# EAGLE schematic source_eagle (EAGLE 9.6.2)
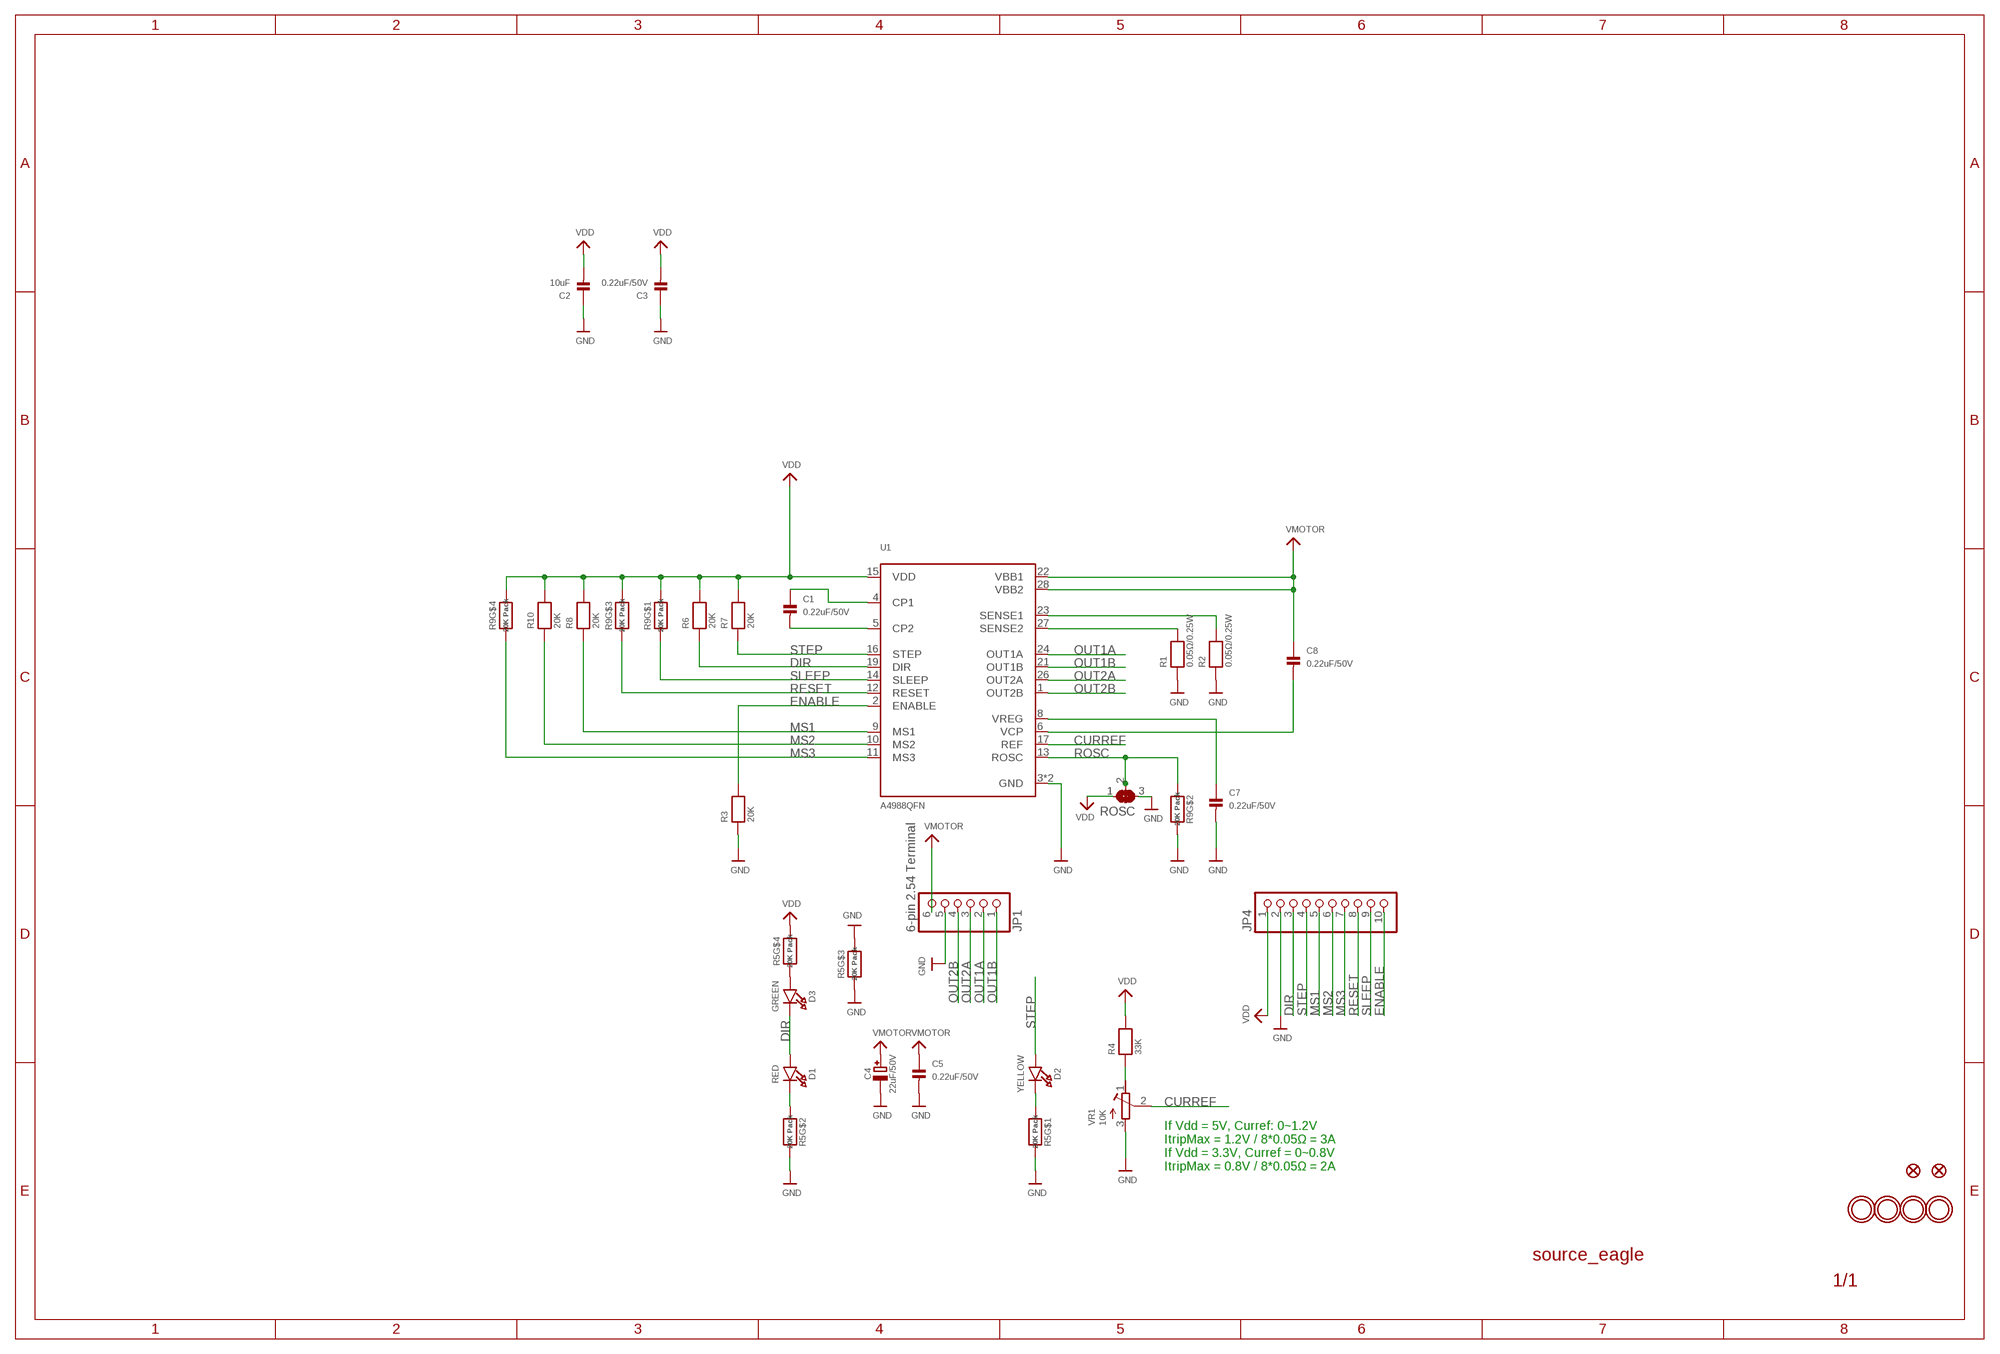
[diagram p0: schematic, sheet 1]

## Parts
C1  0.22uF/50V  CAP_CERAMIC0603_NO  [0603-NO]
C2  10uF  CAP_CERAMIC0805-NOOUTLINE  [0805-NO]
C3  0.22uF/50V  CAP_CERAMIC0603_NO  [0603-NO]
C4  22uF/50V  CAP_ELECTROLYTICPANASONIC_C  [PANASONIC_C]
C5  0.22uF/50V  CAP_CERAMIC0603_NO  [0603-NO]
C7  0.22uF/50V  CAP_CERAMIC0603_NO  [0603-NO]
C8  0.22uF/50V  CAP_CERAMIC0603_NO  [0603-NO]
D1  RED  LED0603_NOOUTLINE  [CHIPLED_0603_NOOUTLINE]
D2  YELLOW  LED0603_NOOUTLINE  [CHIPLED_0603_NOOUTLINE]
D3  GREEN  LED0603_NOOUTLINE  [CHIPLED_0603_NOOUTLINE]
JP1  6-pin 2.54 Terminal  HEADER-1X6_2.54MMTERM  [1X06_2.54MMTERMINAL]
JP4  HEADER-1X1070MIL  [1X10_ROUND70]
R1  0.05Ω/0.25W  RESISTOR_0603_NOOUT  [0603-NO]
R2  0.05Ω/0.25W  RESISTOR_0603_NOOUT  [0603-NO]
R3  20K  RESISTOR_0603_NOOUT  [0603-NO]
R4  33K  RESISTOR_0603_NOOUT  [0603-NO]
R5  20K Pack  RESISTOR_4PACK  [RESPACK_4X0603]
R6  20K  RESISTOR_0603_NOOUT  [0603-NO]
R7  20K  RESISTOR_0603_NOOUT  [0603-NO]
R8  20K  RESISTOR_0603_NOOUT  [0603-NO]
R9  20K Pack  RESISTOR_4PACK  [RESPACK_4X0603]
R10  20K  RESISTOR_0603_NOOUT  [0603-NO]
ROSC  SOLDERJUMPER_2WAY  [SOLDERJUMPER_2WAY_OPEN_NOPASTE]
U1  A4988QFN  A4983_LOGICAL  [QFN28_5MM]
U$10  FIDUCIAL_0.5MM  [FIDUCIAL_0.5MM]
U$11  FIDUCIAL_0.5MM  [FIDUCIAL_0.5MM]
U$18  MOUNTINGHOLE2.0  [MOUNTINGHOLE_2.0_PLATED]
U$22  MOUNTINGHOLE2.0  [MOUNTINGHOLE_2.0_PLATED]
U$26  MOUNTINGHOLE2.0  [MOUNTINGHOLE_2.0_PLATED]
U$27  MOUNTINGHOLE2.0  [MOUNTINGHOLE_2.0_PLATED]
VR1  10K  R-TRIMM3314J  [RTRIM3314J]

## Nets
CURREF: U1.17(REF) VR1.2(S)
DIR: D1.A D3.C JP4.3 R6.1 U1.19(DIR)
ENABLE: JP4.10 R3.2 U1.2(ENABLE)
GND: C2.1 C3.1 C4.- C5.2 C7.2 JP1.5 JP4.2 R1.1 R2.1 R3.1 R5.3 R5.6 R5.7 R5.8 R9.7 ROSC.3 U1.3(GND) U1.THERMAL(GND) VR1.3(A)
MS1: JP4.5 R8.1 U1.9(MS1)
MS2: JP4.6 R10.1 U1.10(MS2)
MS3: JP4.7 R9.4 U1.11(MS3)
N$1: D2.C R5.1
N$2: C1.1 U1.4(CP1)
N$3: C1.2 U1.5(CP2)
N$4: C8.2 U1.6(VCP)
N$5: R1.2 U1.27(SENSE2)
N$6: R2.2 U1.23(SENSE1)
N$7: C7.1 U1.8(VREG)
N$8: D1.C R5.2
N$9: R4.1 VR1.1(E)
N$10: D3.A R5.4
OUT1A: JP1.2 U1.24(OUT1A)
OUT1B: JP1.1 U1.21(OUT1B)
OUT2A: JP1.3 U1.26(OUT2A)
OUT2B: JP1.4 U1.1(OUT2B)
RESET: JP4.8 R9.3 U1.12(RESET)
ROSC: R9.2 ROSC.2 U1.13(ROSC)
SLEEP: JP4.9 R9.1 U1.14(SLEEP)
STEP: D2.A JP4.4 R7.1 U1.16(STEP)
VDD: C2.2 C3.2 JP4.1 R4.2 R5.5 R6.2 R7.2 R8.2 R9.5 R9.6 R9.8 R10.2 ROSC.1 U1.15(VDD)
VMOTOR: C4.+ C5.1 C8.1 JP1.6 U1.22(VBB1) U1.28(VBB2)

## Notes on the sheet
- If Vdd = 5V, Curref: 0~1.2V
  ItripMax = 1.2V / 8*0.05Ω = 3A
  If Vdd = 3.3V, Curref = 0~0.8V
  ItripMax = 0.8V / 8*0.05Ω = 2A

## Library data of the parts
C1-C3 C5 C7 C8 = microbuilder:CAP_CERAMIC: Ceramic Capacitors For new designs, use the packages preceded by an '_' character since they are more reliable: The following footprints should be used on most boards: _0402 - Standard footprint for regular board layouts _0603 - Standard footprint for regular board layouts _0805 - Standard footprint for regular board layouts _1206 - Standard footprint for regular board layouts For extremely tight-pitch boards where space is at a premium, the following 'micro-pitch' footprints can be used (smaller pads, no silkscreen outline, etc.): _0402MP - Micro-pitch footprint for very dense/compact boards _0603MP - Micro-pitch footprint for very dense/compact boards _0805MP - Micro-pitch footprint for very dense/compact boards _1206MP - Micro-pitch footprint for very dense/compact boards
C4 = microbuilder:CAP_ELECTROLYTIC: Electrolytic Capacitors SMT PANASONIC_C - Size C Panasonic Electrolytic Aluminum Capacitor 47µF 16V 20% Electrolytic Capacitor [Digikey: PCE3890TR-ND] PANASONIC_D - Size D Panasonic Electrolytic Aluminum Capacitor 100µF 25V 20% Electrolytic Capacitor [Digikey: PCE3898TR-ND] PTH 3.5 mm grid, 8 mm diameter ... 3.5 mm grid, 10 mm diameter ...
D1-D3 = microbuilder:LED: LED 0603 - 0603 Surface Mount Package 2mA: Green LED - Low Power (3.9mcd, 2ma, 1.7Vf) - Digikey: 475-2709-2-ND Orange LED - Low Power (9.8mcd, 2ma, 1.8Vf) - Digikey: 475-1194-2-ND Red LED - Low Power (5mcd, 2ma, 1.8Vf) - Digikey: 475-1195-2-ND Yellow LED - Low Power (7mcd, 2ma, 1.8Vf) - Digikey: 475-1196-2-ND 5mA: Blue LED - Low Power (17mcd, 5ma, 2.9Vf) - Digikey: LNJ937W8CRACT-ND 0805 - 0805 Surface Mount Package 2mA: Red LED (8.8mcd, 2mA, 1.8Vf, Clear) - Low Power [Digikey: 475-2510-1-ND] Green LED (5mcd, 2mA, 1.8Vf, Clear) - Low Power [Digikey: 475-2730-1-ND] Yellow LED (11.3mcd, 2mA, 1.8Vf, Clear) - Low Power [Digikey: 475-2555-1-ND] 20mA: Red LED (104mcd, 20mA, Diffused) - LS R976 [Digikey: 475-1278-6-ND] Red LED (12mcd, 20mA, 2.0Vf, Clear) - APT2012EC [Digikey: 754-1128-1-ND] Green LED (15mcd, 20mA, 2.2Vf, Clear) - APT2012GC [Digikey: 754-1131-1-ND] Orange LED (160mcd, 20mA, 2.1Vf, Clear) - APT2012SECK [Digikey: 754-1130-1-ND] 1206 - 1206 Surface Mount Package Green LED (26mcd, 20mA, Diffused) - LG N971 [Digikey: 475-1407-6-ND] Red LED (15mcd, 20mA, Diffused) - LH N974 [Digikey: 475-1416-6-ND] Cree - Cree High-Power Surface Mount LEDs XPEBWT-L1-0000-00D50 - White 111lm 350mA 2.9Vf 6200K 110° XTEAWT-00-0000-00000LEE3 - White 114lm 350mA 2.85Vf 5000K 115° Everlight - Everlight 45-21 Series Surface Mount LEDs 45-21/QK2C-B2832AC2CB2/2T - Warm White 2000mcd 20mA 3.25Vf 3050K 120° 45-21/LK2C-B38452C4CB2/2T - Nuetral White 2000mcd 20mA 3.25Vf 4150K 120° 45-21/LK2C-B50634C6CB2/2T - Cold White 2200mcd 20mA 3.25Vf 5650K 120° PLCC2 Reverse Mount LS T77K-J1L2-1-0-2-R18-Z - Red 11.25mcd 2mA 1.8Vf 630nm 120° LO T77K-L1M2-24-Z - Orange 19.6mcd 2mA 1.8Vf 606nm 120° LY T77K-K2M1-26-Z - Yellow 15.7mcd 2mA 1.8Vf 587nm 120°; ROT: 270
JP1 = microbuilder:HEADER-1X6: PIN HEADER
JP4 = microbuilder:HEADER-1X10: PIN HEADER
R1-R4 R6-R8 R10 = microbuilder:RESISTOR: Resistors For new designs, use the packages preceded by an '_' character since they are more reliable: The following footprints should be used on most boards: _0402 - Standard footprint for regular board layouts _0603 - Standard footprint for regular board layouts _0805 - Standard footprint for regular board layouts _1206 - Standard footprint for regular board layouts For extremely tight-pitch boards where space is at a premium, the following 'micro-pitch' footprints can be used (smaller pads, no silkscreen outline, etc.): _0402MP - Micro-pitch footprint for very dense/compact boards _0603MP - Micro-pitch footprint for very dense/compact boards _0805MP - Micro-pitch footprint for very dense/compact boards _1206MP - Micro-pitch footprint for very dense/compact boards
R5 R9 = microbuilder:RESISTOR_4PACK: Resistor Packs (4 resistors) 4 x 0603 10K 1/16W - Digikey: YC164J-10KCT-ND
ROSC = microbuilder:SOLDERJUMPER_2WAY: 2-Way Solder Jumper
U1 = microbuilder:A4983_LOGICAL: A4983 2A Micro-Stepping Stepper Motor Driver Logic: 3.0-5.5V Load Supply: 8.0-35V
U$10 U$11 = microbuilder:FIDUCIAL: Fiducial Alignment Points Various fiducial points for machine vision alignment.
U$18 U$22 U$26 U$27 = adafruit_electromech:MOUNTINGHOLE: Mounting Hole For #2 screws (0.086"/2.18mm width, 0.094"/2.4mm hole) use 2.5mm; BOM: EXCLUDE
VR1 = adafruit_electromech:R-TRIMM: Trimm resistor; SPICEMODEL: X; SPICEPREFIXL: POT